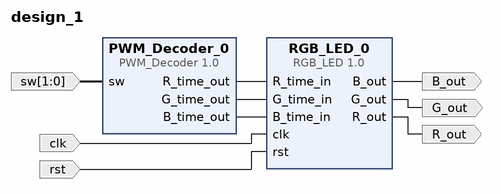
[diagram p0: block diagram of the top level]
# Vivado block design design_1, xc7z020clg400-1, Vivado 2018.3
create_bd_design design_1

create_bd_port -dir I -from 1 -to 0 sw
create_bd_port -dir I clk
create_bd_port -dir I rst
create_bd_port -dir O B_out
create_bd_port -dir O G_out
create_bd_port -dir O R_out

create_bd_cell -type ip -vlnv xilinx.com:user:RGB_LED:1.0 RGB_LED_0
create_bd_cell -type ip -vlnv xilinx.com:user:PWM_Decoder:1.0 PWM_Decoder_0

# ---- connections ----

connect_bd_net [get_bd_ports sw] [get_bd_pins PWM_Decoder_0/sw]
connect_bd_net [get_bd_pins PWM_Decoder_0/R_time_out] [get_bd_pins RGB_LED_0/R_time_in]
connect_bd_net [get_bd_pins PWM_Decoder_0/G_time_out] [get_bd_pins RGB_LED_0/G_time_in]
connect_bd_net [get_bd_pins PWM_Decoder_0/B_time_out] [get_bd_pins RGB_LED_0/B_time_in]
connect_bd_net [get_bd_ports clk] [get_bd_pins RGB_LED_0/clk]
connect_bd_net [get_bd_ports rst] [get_bd_pins RGB_LED_0/rst]
connect_bd_net [get_bd_pins RGB_LED_0/B_out] [get_bd_ports B_out]
connect_bd_net [get_bd_pins RGB_LED_0/G_out] [get_bd_ports G_out]
connect_bd_net [get_bd_pins RGB_LED_0/R_out] [get_bd_ports R_out]

validate_bd_design
save_bd_design
